# Altium schematic sheet balancer.SchDoc
size A4; SheetNumber: 6; SheetTotal: 6
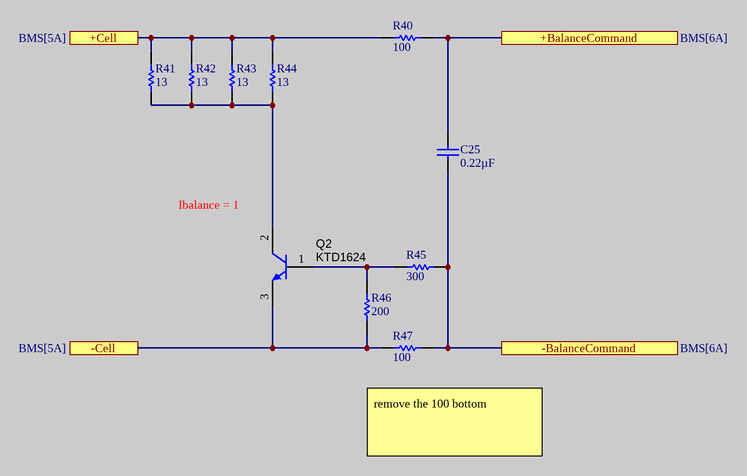
[diagram p0: balancer.SchDoc]

## Parts
C25  0.22µF  [CAPC0603]
Q2  KTD1624  [sot-89]
R40  100  [RESC0603]
R41  13  [RES2512]
R42  13  [RES2512]
R43  13  [RES2512]
R44  13  [RES2512]
R45  300  [RESC0603]
R46  200  [RESC0603]
R47  100  [RESC0603]

## Ports
+BalanceCommand (see BMS[6A]), +Cell (see BMS[5A]), -BalanceCommand (see BMS[6A]), -Cell (see BMS[5A])

## Nets
+BalanceCommand: C25.2 R40.2 ; port +BalanceCommand
+Cell: R40.1 R41.1 R42.1 R43.1 R44.1 ; port +Cell
-BalanceCommand: C25.1 R45.2 R47.2 ; port -BalanceCommand
-Cell: Q2.3(E) R46.1 R47.1 ; port -Cell
NetQ2_1: Q2.1(B) R45.1 R46.2
NetQ2_2: Q2.2(C) R41.2 R42.2 R43.2 R44.2

## Notes on the sheet
- (near Q2) Ibalance = 1
- (near R47) remove the 100 bottom

## Library data of the parts
C25 = Capacitor: Published: 8-Jun-2000; LatestRevisionDate: 17-Jul-2002; LatestRevisionNote: Re-released for DXP Platform.; PackageReference: C0805; Publisher: Altium Limited; Value: 0.22µF
Q2 = BSR14, Nexperia: BJT 30V 3A 40V 10W SI-NPN; PartNumber: BSR14; U/M: EA; Value1: 0.8 A; Value2: 300; SizeAreaWB_mm2: 14; SizeArea_mm2: 7.5; SizeX_mm: 2.5; SizeY_mm: 3; SizeZ_mm: 1.1; AEC Category: Q101; PNP: 0; NPN: 1; Vceo_V: 40; Vcesat1_V: 0.3; IcRated_A: 0.8; TaMin_C: -65; TaMax_C: 150; SymbolVersion: 2008-07-31; CompType: BJT; Manufacturer: Nexperia; PackageReference: SOT-23; Value: 40 V; RoHS: Y; MountType: SMT; Published: 2008-07-31; Publisher: Texas Instruments; LatestRevisionDate: 2017-06-09; ComponentLink1Description: Datasheet link; ComponentLink1URL: http://www.nexperia.com/documents/data_sheet/BSR13_BSR14.pdf; Supplier 1: Digi-Key; Supplier Part Number 1: 568-6225-1-ND; AEC Qualified: ?; HfeMax: 300
R40-R47 = Resistor: 0603,0.1W; Published: 8-Jun-2000; LatestRevisionDate: 17-Jul-2002; LatestRevisionNote: Re-released for DXP Platform.; PackageReference: AXIAL-0.5; Publisher: Altium Limited
  R40 R47: Value: 100
  R41-R44: Value: 13
  R45: Value: 300
  R46: Value: 200